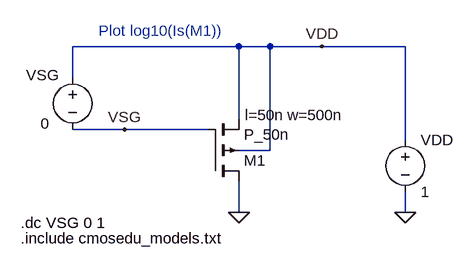
[diagram p0: schematic Fig14_2_PMOS.asc]
Fig14_2_PMOS.asc, the LTspice schematic file:
Version 4
SHEET 1 3172 680
WIRE 448 -368 192 -368
WIRE 496 -368 448 -368
WIRE 576 -368 496 -368
WIRE 704 -368 576 -368
WIRE 192 -320 192 -368
WIRE 448 -256 448 -368
WIRE 272 -240 192 -240
WIRE 400 -240 272 -240
WIRE 704 -224 704 -368
WIRE 496 -208 496 -368
WIRE 496 -208 448 -208
WIRE 448 -112 448 -160
WIRE 704 -112 704 -144
FLAG 704 -112 0
FLAG 576 -368 VDD
FLAG 448 -112 0
FLAG 272 -240 VSG
SYMBOL voltage 704 -240 R0
WINDOW 123 0 0 Left 2
WINDOW 39 0 0 Left 2
SYMATTR InstName VDD
SYMATTR Value 1
SYMBOL voltage 192 -336 R0
WINDOW 3 -49 87 Left 2
WINDOW 123 0 0 Left 2
WINDOW 39 0 0 Left 2
WINDOW 0 -72 12 Left 2
SYMATTR Value 0
SYMATTR InstName VSG
SYMBOL pmos4 400 -160 M180
WINDOW 123 57 102 Left 2
SYMATTR Value2 l=50n w=500n
SYMATTR InstName M1
SYMATTR Value P_50n
TEXT 112 -96 Left 2 !.dc VSG 0 1
TEXT 112 -72 Left 2 !.include cmosedu_models.txt
TEXT 232 -392 Left 2 ;Plot log10(Is(M1))

The netlist it stands for:
* Fig14_2_PMOS.asc
VDD VDD 0 1
VSG VDD VSG 0
M1 0 VSG VDD VDD P_50n l=50n w=500n
.model NMOS NMOS
.model PMOS PMOS
.lib standard.mos
.dc VSG 0 1
.include cmosedu_models.txt
* Plot log10(Is(M1))
.backanno
.end